# Altium schematic sheet CPU.SchDoc
size A4; SheetNumber: 1; SheetTotal: 5
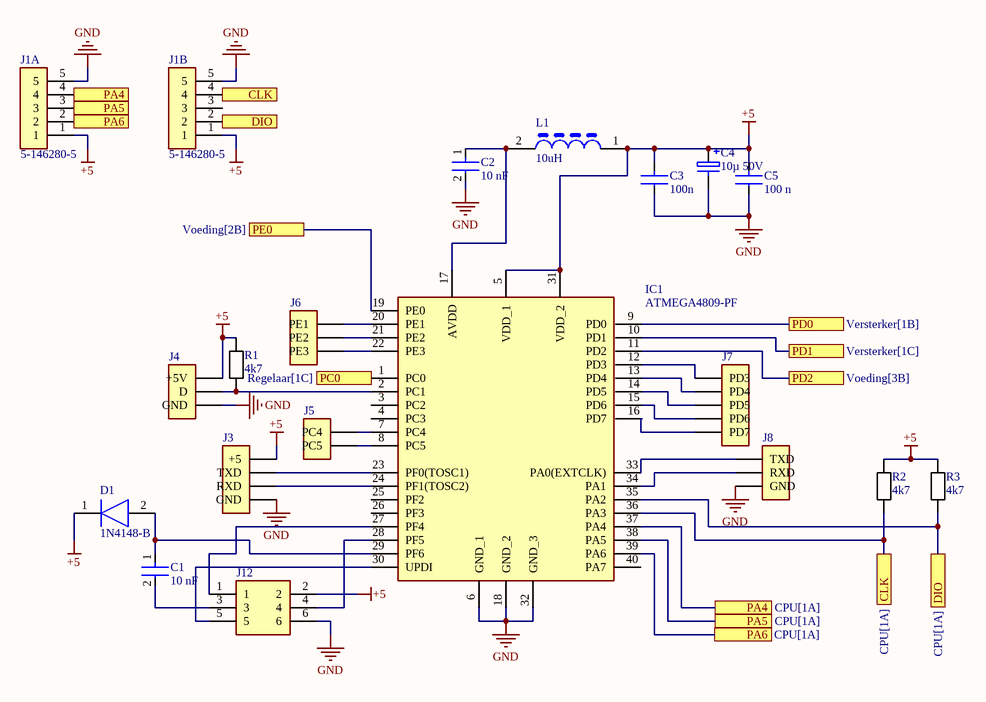
[diagram p0: CPU.SchDoc]

## Parts
C1  10 nF  [0805]
C2  10 nF  [0805]
C3  100n  [0805]
C4  10µ 50V  [Elco 100uF 25V]
C5  100 n  [0805]
D1  1N4148-B  [1N4148]
IC1  ATMEGA4809-PF  [ATMEGA4809-PF(integraded circuit)]
J1A  5-146280-5  [5 Pin Header]
J1B  5-146280-5  [5 Pin Header]
J3  5-146280-4  [4 Pin Header]  (value not drawn)
J4  5-146280-3  [3 Pin Header]  (value not drawn)
J5  5-146280-2  [2 Pin Header]  (value not drawn)
J6  5-146280-3  [3 Pin Header]  (value not drawn)
J7  5-146280-5  [5 Pin Header]  (value not drawn)
J8  5-146280-3  [3 Pin Header]  (value not drawn)
J12  2x3 Pin Header  [2x3 Pin Header]  (value not drawn)
L1  10uH  [Smoorspoel]
R1  4k7  [weerstand]
R2  4k7  [weerstand]
R3  4k7  [weerstand]

## Ports
CLK (see CPU[1A]), CLK (see CPU[3C]), DIO (see CPU[1A]), DIO (see CPU[3C]), PA4 (see CPU[1A]), PA4 (see CPU[3C]), PA5 (see CPU[1A]), PA5 (see CPU[3C]), PA6 (see CPU[1A]), PA6 (see CPU[3C]), PC0 (see Regelaar[1C]), PD0 (see Versterker[1B]), PD1 (see Versterker[1C]), PD2 (see Voeding[3B]), PE0 (see Voeding[2B])

## Nets
+5: C3.1 C4.1 C5.1 D1.1(K) IC1.5(VDD_1) IC1.31(VDD_2) J1A.1 J1B.1 J3.1(+5) J4.1(+5V) J12.2 L1.1 R1.2 R2.2 R3.2
GND: C2.2 C3.2 C4.2 C5.2 IC1.6(GND_1) IC1.18(GND_2) IC1.32(GND_3) J1A.5 J1B.5 J3.4(GND) J4.3(GND) J8.3(GND) J12.6
CLK: IC1.36(PA3) J1B.4 R2.1 ; port CLK
DIO: IC1.35(PA2) J1B.2 R3.1 ; port DIO
PA4: IC1.37(PA4) J1A.4 ; port PA4
PA5: IC1.38(PA5) J1A.3 ; port PA5
PA6: IC1.39(PA6) J1A.2 ; port PA6
PC0: IC1.1(PC0) ; port PC0
PD0: IC1.9(PD0) ; port PD0
PD1: IC1.10(PD1) ; port PD1
PD2: IC1.11(PD2) ; port PD2
PE0: IC1.19(PE0) ; port PE0
NetC1_1: C1.1 D1.2(A) IC1.29(PF6)
NetC1_2: C1.2 J12.3
NetC2_1: C2.1 IC1.17(AVDD) L1.2
NetIC1_2: IC1.2(PC1) J4.2(D) R1.1
NetIC1_7: IC1.7(PC4) J5.1(PC4)
NetIC1_8: IC1.8(PC5) J5.2(PC5)
NetIC1_12: IC1.12(PD3) J7.1(PD3)
NetIC1_13: IC1.13(PD4) J7.2(PD4)
NetIC1_14: IC1.14(PD5) J7.3(PD5)
NetIC1_15: IC1.15(PD6) J7.4(PD6)
NetIC1_16: IC1.16(PD7) J7.5(PD7)
NetIC1_20: IC1.20(PE1) J6.1(PE1)
NetIC1_21: IC1.21(PE2) J6.2(PE2)
NetIC1_22: IC1.22(PE3) J6.3(PE3)
NetIC1_23: IC1.23(PF0(TOSC1)) J3.2(TXD)
NetIC1_24: IC1.24(PF1(TOSC2)) J3.3(RXD)
NetIC1_27: IC1.27(PF4) J12.1
NetIC1_28: IC1.28(PF5) J12.4
NetIC1_30: IC1.30(UPDI) J12.5
NetIC1_33: IC1.33(PA0(EXTCLK)) J8.1(TXD)
NetIC1_34: IC1.34(PA1) J8.2(RXD)

Not connected (* = marked no-connect by the designer): IC1 3(PC2) 4(PC3) 25(PF2) 26(PF3) 40(PA7); J1B 3

## Library data of the parts
C1-C3 C5 = Condensator 0805: Chip Multilayer Ceramic Capacitors for General Purpose, 0805, 10uF, X5R, 15%, 10%, 25V; Length: 2mm; Depth: 1.25mm; Termination: SMD/SMT; Voltage: 25V; Height: 1.25mm; Material: Ceramic; Thickness: 0.053inch; Radiation Hardening: No; Min Operating Temperature: -55°C; Width: 0.049inch; Package Quantity: 1; Mount: Surface Mount; Dielectric: X5R; Packaging: Tape and Reel; Capacitance: 10uF; Voltage Rating (DC): 25V; Lead Free: Lead Free; Max Operating Temperature: 85°C; Case Code (Imperial): 0805; Case/Package: 0805; Tolerance: 10%; Voltage Rating: 25V; Case Code (Metric): 2012
C4 = Condensator Elco: Part Number: 02015A270JAT2A; Manufacturer: AVX Interconnect / Elco
D1 = 1N4148-B: Diode; Manufacturer_Name: Rectron; Manufacturer_Part_Number: 1N4148-B
IC1 = ATMEGA4809-PF: Integrated Circuit; Manufacturer_Name: Microchip; Datasheet Link: https://componentsearchengine.com//ATMEGA4809-PF.pdf; Height: 6.35mm; Mouser2 Part Number: 556-ATMEGA4809-PF; Mouser2 Price/Stock: https://www.mouser.com/Search/Refine.aspx?Keyword=556-ATMEGA4809-PF; Manufacturer_Part_Number: ATMEGA4809-PF
J1A J1B J7 = 5 Pin Header: Connector 5-146280-5; Manufacturer_Name: TE Connectivity; Datasheet Link: https://componentsearchengine.com//5-146280-5.pdf; Height: 8.21mm; Mouser2 Part Number: 571-5-146280-5; Mouser2 Price/Stock: https://www.mouser.com/Search/Refine.aspx?Keyword=571-5-146280-5; Manufacturer_Part_Number: 5-146280-5
J3 = 4 Pin Header L: Connector 5-146280-4; Manufacturer_Name: TE Connectivity; Datasheet Link: https://datasheet.datasheetarchive.com/originals/distributors/DKDS-20/396066.pdf; Height: 8.21mm; Manufacturer_Part_Number: 5-146280-4
J4 J6 = 3 Pin Header L: Connector 5-146280-3; Manufacturer_Name: TE Connectivity; Datasheet Link: https://componentsearchengine.com//5-146280-3.pdf; Height: 8.21mm; Mouser2 Part Number: 571-5-146280-3; Mouser2 Price/Stock: https://www.mouser.com/Search/Refine.aspx?Keyword=571-5-146280-3; Manufacturer_Part_Number: 5-146280-3
J5 = 2 Pin Header L: Connector; Manufacturer_Name: TE Connectivity; Datasheet Link: http://www.te.com/commerce/DocumentDelivery/DDEController?Action=showdoc&DocId=Customer+Drawing%7F146280%7FH2%7Fpdf%7FEnglish%7FENG_CD_146280_H2.pdf%7F5-146280-2; Height: 8.72mm; Manufacturer_Part_Number: 5-146280-2
J8 = 3 Pin Header R: Connector 5-146280-3; Manufacturer_Name: TE Connectivity; Datasheet Link: https://componentsearchengine.com//5-146280-3.pdf; Height: 8.21mm; Mouser2 Part Number: 571-5-146280-3; Mouser2 Price/Stock: https://www.mouser.com/Search/Refine.aspx?Keyword=571-5-146280-3; Manufacturer_Part_Number: 5-146280-3
J12 = 2x3 Pin Header: Connector; Manufacturer_Name: TE Connectivity; Manufacturer_Part_Number: 5-146256-3; Datasheet Link: https://www.te.com/commerce/DocumentDelivery/DDEController?Action=srchrtrv&DocNm=146256&DocType=Customer+Drawing&DocLang=English; Height: 8.72mm
L1 = Smoorspoel: Inductor VLS6045EX-100M-H; Manufacturer_Name: TDK; Datasheet Link: https://componentsearchengine.com//VLS6045EX-100M-H.pdf; Mouser2 Part Number: 810-VLS6045EX-100M-H; Mouser2 Price/Stock: https://www.mouser.com/Search/Refine.aspx?Keyword=810-VLS6045EX-100M-H; Manufacturer_Part_Number: VLS6045EX-100M-H
R1-R3 = weerstand: Manufacturer: Vishay Dale; Part Number: CRCW08050000Z0EA